# EAGLE design charging_block_v3 (EAGLE 8.2.1)
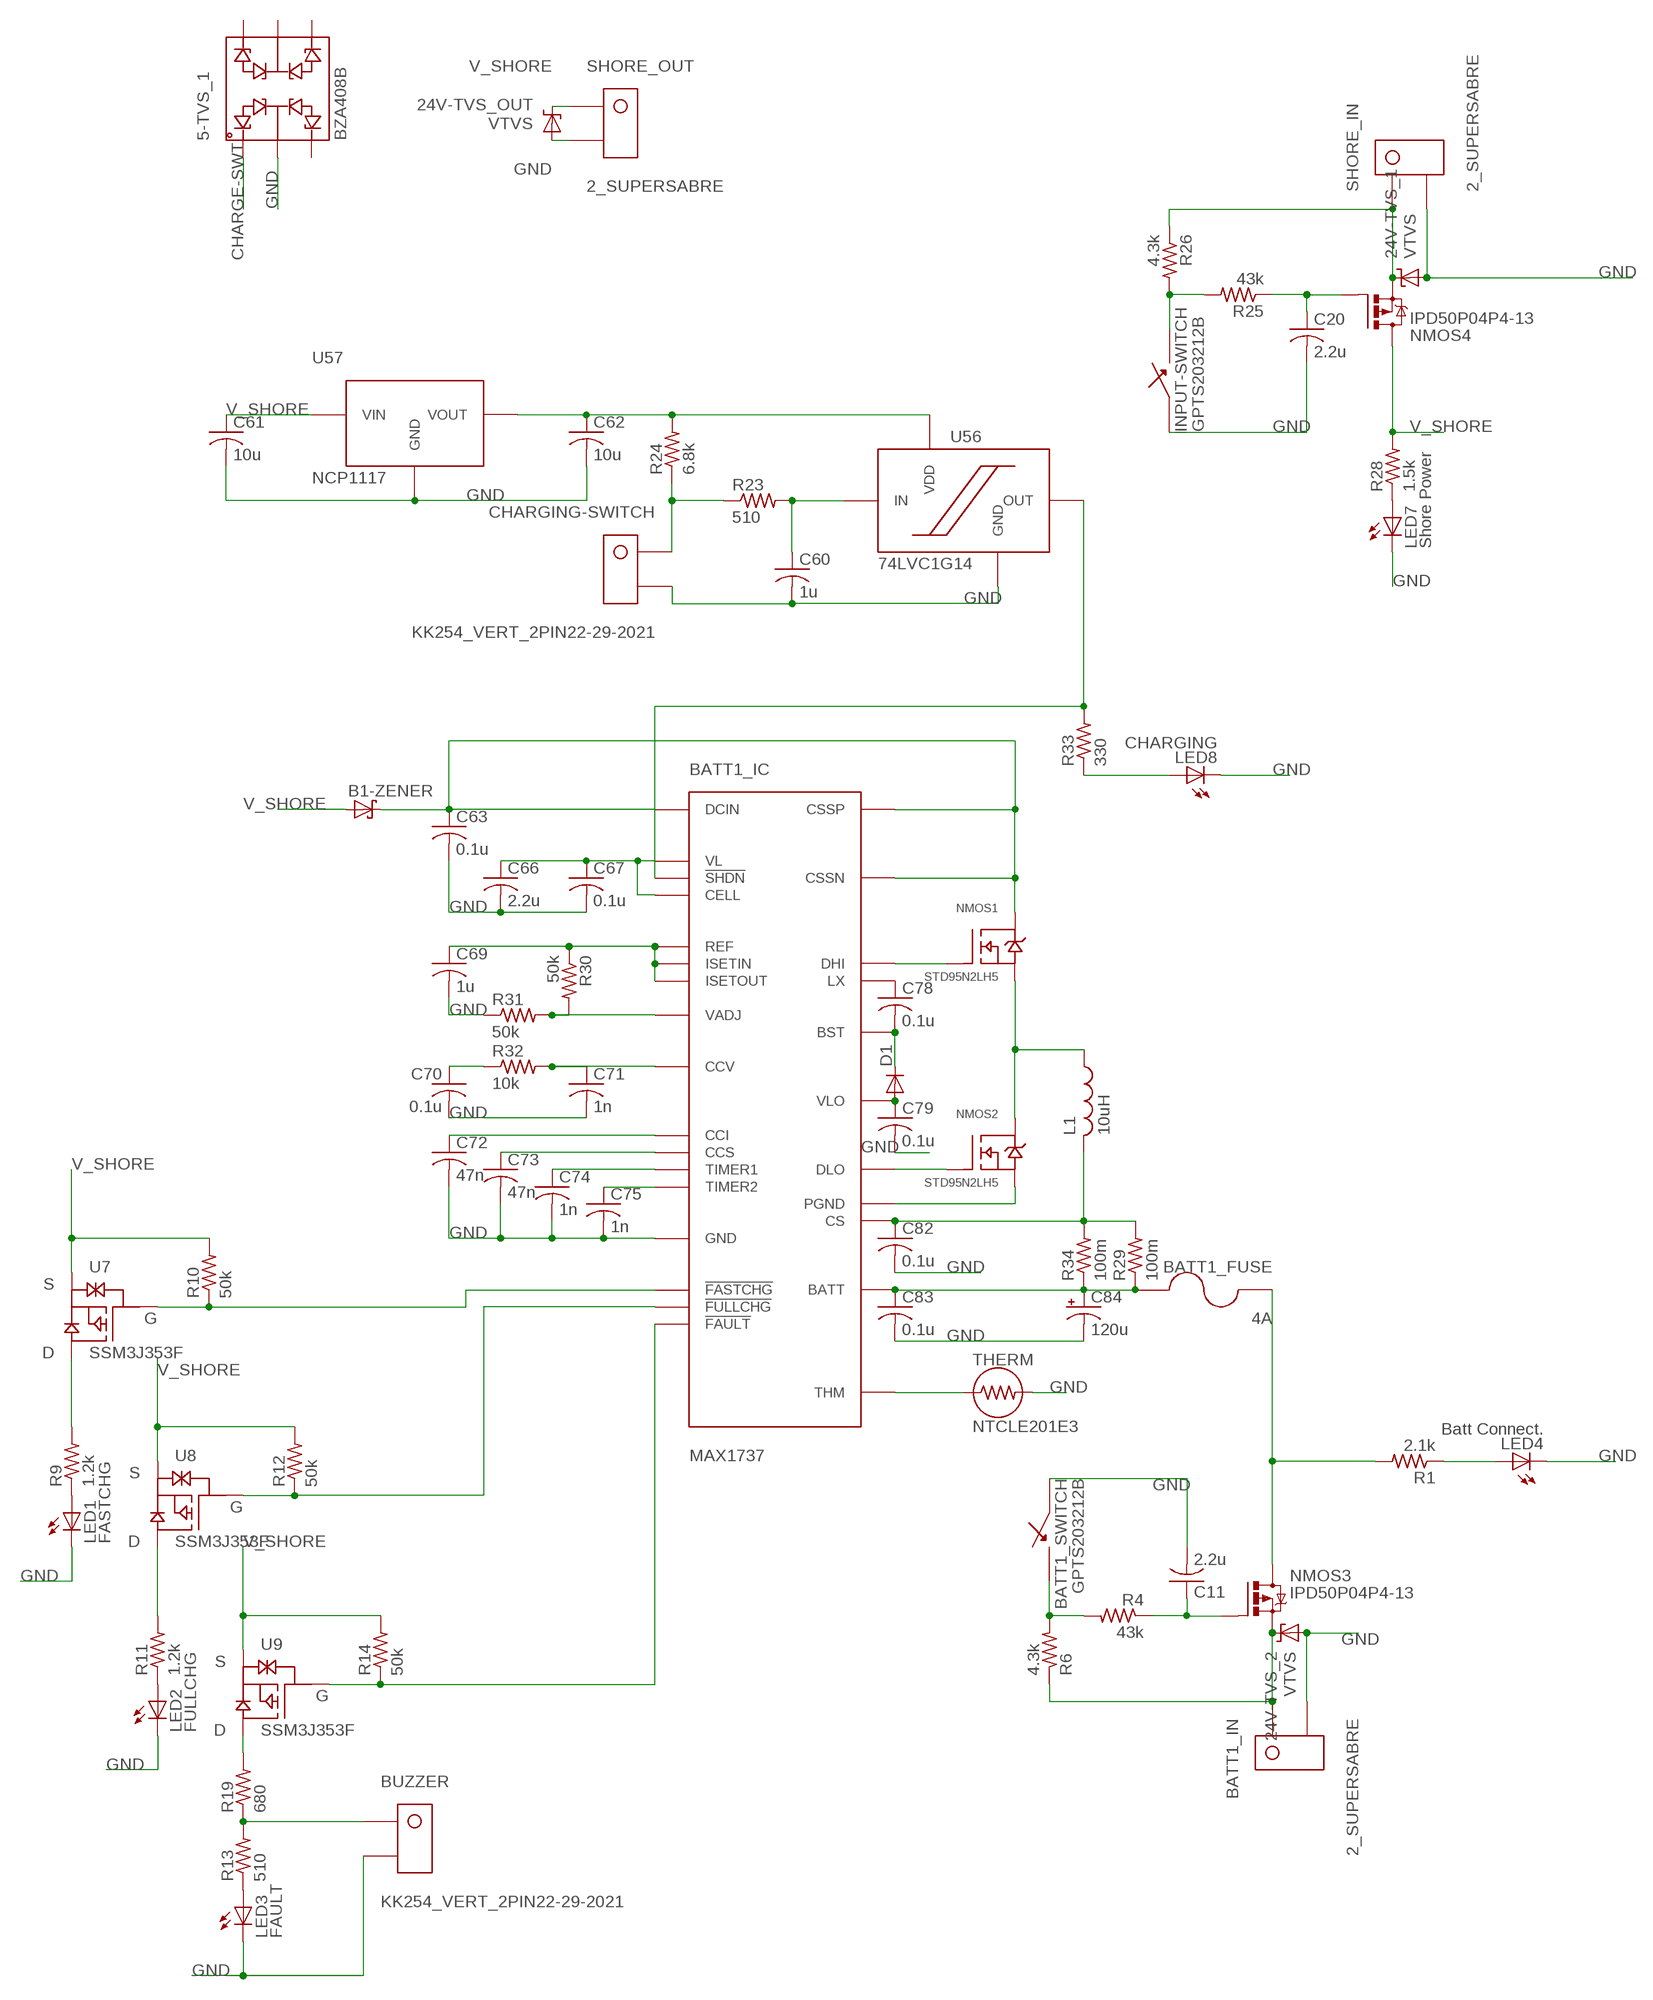
[diagram p0: schematic, sheet 1]

## Parts
5-TVS_1  BZA408B  [SOT457]
24V-TVS_1  VTVS  [DO-219AB]
24V-TVS_2  VTVS  [DO-219AB]
24V-TVS_OUT  VTVS  [DO-219AB]
B1-ZENER  SCHOTTKY-DIODESOD-106  [SOD106-R]
BATT1_FUSE  4A  154-OMNI_BLOK  [154-OMNI-BLOK]
BATT1_IC  MAX1737  [QSOP28]
BATT1_IN  2_SUPERSABRE  [SUPERSABRE_2CIRCUIT]
BATT1_SWITCH  GPTS203212B  [GPTS203211B]
BUZZER  KK254_VERT_2PIN22-29-2021  [KK254_VERT_2PIN]
C11  2.2u  C-USC0805  [C0805]
C20  2.2u  C-USC0805  [C0805]
C60  1u  C-USC0805  [C0805]
C61  10u  C-USC0805  [C0805]
C62  10u  C-USC0805  [C0805]
C63  0.1u  C-USC0805  [C0805]
C66  2.2u  C-USC0805  [C0805]
C67  0.1u  C-USC0805  [C0805]
C69  1u  C-USC0805  [C0805]
C70  0.1u  C-USC0805  [C0805]
C71  1n  C-USC0805  [C0805]
C72  47n  C-USC0805  [C0805]
C73  47n  C-USC0805  [C0805]
C74  1n  C-USC0805  [C0805]
C75  1n  C-USC0805  [C0805]
C78  0.1u  C-USC0805  [C0805]
C79  0.1u  C-USC0805  [C0805]
C82  0.1u  C-USC0805  [C0805]
C83  0.1u  C-USC0805  [C0805]
C84  120u  CPOL-USE3.5-8  [E3,5-8]
CHARGING-SWITCH  KK254_VERT_2PIN22-29-2021  [KK254_VERT_2PIN]
D1  DIODE-SOD123  [SOD123]
INPUT-SWITCH  GPTS203212B  [GPTS203211B]
L1  10uH  L-USL6100  [L6100]
LED1  FASTCHG  LEDCHIP-LED0805  [CHIP-LED0805]
LED2  FULLCHG  LEDCHIP-LED0805  [CHIP-LED0805]
LED3  FAULT  LEDCHIP-LED0805  [CHIP-LED0805]
LED4  Batt Connect.  LEDCHIP-LED0805  [CHIP-LED0805]
LED7  Shore Power  LEDCHIP-LED0805  [CHIP-LED0805]
LED8  CHARGING  LEDCHIP-LED0805  [CHIP-LED0805]
NMOS1  STD95N2LH5  [DPAK]
NMOS2  STD95N2LH5  [DPAK]
NMOS3  IPD50P04P4-13  [TO252-3]
NMOS4  IPD50P04P4-13  [TO252-3]
R1  2.1k  R-US_R0805  [R0805]
R4  43k  R-US_R0805  [R0805]
R6  4.3k  R-US_R0805  [R0805]
R9  1.2k  R-US_R0805  [R0805]
R10  50k  R-US_R0805  [R0805]
R11  1.2k  R-US_R0805  [R0805]
R12  50k  R-US_R0805  [R0805]
R13  510  R-US_R0805  [R0805]
R14  50k  R-US_R0805  [R0805]
R19  680  R-US_R0805  [R0805]
R23  510  R-US_R0805  [R0805]
R24  6.8k  R-US_R0805  [R0805]
R25  43k  R-US_R0805  [R0805]
R26  4.3k  R-US_R0805  [R0805]
R28  1.5k  R-US_R0805  [R0805]
R29  100m  R-US_R2512  [R2512]
R30  50k  R-US_R0805  [R0805]
R31  50k  R-US_R0805  [R0805]
R32  10k  R-US_R0805  [R0805]
R33  330  R-US_R0805  [R0805]
R34  100m  R-US_R2512  [R2512]
SHORE_IN  2_SUPERSABRE  [SUPERSABRE_2CIRCUIT]
SHORE_OUT  2_SUPERSABRE  [SUPERSABRE_2CIRCUIT]
THERM  NTCLE201E3  [2-0.3MM-LEADS]
U7  SSM3J353F  [SOT-346-3/S-MINI]
U8  SSM3J353F  [SOT-346-3/S-MINI]
U9  SSM3J353F  [SOT-346-3/S-MINI]
U56  74LVC1G14  [TSSOP5]
U57  NCP1117  [SOT-223]

## Nets
!FASTCHG!_1: BATT1_IC.16(!FASTCHG!) R10.1 U7.P$1(G)
!FAULT!_1: BATT1_IC.15(!FAULT!) R14.1 U9.P$1(G)
!FULLCHG!_1: BATT1_IC.17(!FULLCHG!) R12.1 U8.P$1(G)
!SHDN!_1: BATT1_IC.18(!SHDN!) R33.2 U56.P$4(OUT)
BATT1_P: 24V-TVS_2.P$2(C) BATT1_IN.P$1 NMOS3.TAB(D) R6.1
BATT_1: BATT1_FUSE.P$2 BATT1_IC.7(BATT) C83.1 C84.+ R29.1 R34.1
CCI_1: BATT1_IC.11(CCI) C72.1
CCS_1: BATT1_IC.10(CCS) C73.1
CCV_1: BATT1_IC.9(CCV) C71.1 R32.2
CHARGE-SWT: 5-TVS_1.P$1 CHARGING-SWITCH.P$1 R23.1 R24.1
CHG-OUT_1: BATT1_FUSE.P$1 NMOS3.3(S) R1.2
DCIN_1: B1-ZENER.C BATT1_IC.26(CSSN) BATT1_IC.27(CSSP) BATT1_IC.28(DCIN) C63.1 NMOS1.TAB(D)
DHI1: BATT1_IC.25(DHI) NMOS1.1(G)
DLO1: BATT1_IC.21(DLO) NMOS2.1(G)
FET-G_1: C11.1 NMOS3.1(G) R4.1
GND: 5-TVS_1.P$2 24V-TVS_1.P$1(A) 24V-TVS_2.P$1(A) 24V-TVS_OUT.P$1(A) BATT1_IC.6(GND) BATT1_IN.P$2 BATT1_SWITCH.P$1 BUZZER.P$2 C11.2 C20.2 C60.2 C61.2 C62.2 C63.2 C66.2 C67.2 C69.2 C70.2 C71.2 C72.2 C73.2 C74.2 C75.2 C79.2 C82.2 C83.2 C84.- CHARGING-SWITCH.P$2 INPUT-SWITCH.P$1 LED1.C LED2.C LED3.C LED4.C LED7.C LED8.C R31.1 SHORE_IN.P$2 SHORE_OUT.P$2 THERM.P$2 U56.P$3(GND) U57.P$1(GND)
LIN_1: L1.P$1 NMOS1.3(S) NMOS2.TAB(D)
LOUT_1: BATT1_IC.19(CS) C82.1 L1.P$2 R29.2 R34.2
N$1: LED4.A R1.1
N$2: LED1.A R9.1
N$3: BATT1_IC.20(PGND) NMOS2.3(S)
N$12: LED3.A R13.1
N$22: LED2.A R11.1
N$23: R9.2 U7.P$2(D)
N$26: R11.2 U8.P$2(D)
N$29: BUZZER.P$1 R13.2 R19.1
N$30: R19.2 U9.P$2(D)
N$35: LED7.A R28.1
N$47: C20.1 NMOS4.1(G) R25.1
N$49: C60.1 R23.2 U56.P$2(IN)
N$51: INPUT-SWITCH.P$2 R25.2 R26.2
N$52: BATT1_SWITCH.P$2 R4.2 R6.2
N$54: C62.1 R24.2 U56.P$5(VDD) U57.P$2(VOUT) U57.P$4(VOUT)
N$57: LED8.A R33.1
N$64: C70.1 R32.1
N$75: BATT1_IC.24(LX) C78.1
N$76: BATT1_IC.23(BST) C78.2 D1.C
N$83: BATT1_IC.22(VLO) C79.1 D1.A
REF_1: BATT1_IC.2(ISETIN) BATT1_IC.3(ISETOUT) BATT1_IC.5(REF) C69.1 R30.1
THM1: BATT1_IC.4(THM) THERM.P$1
TIMER1_1: BATT1_IC.13(TIMER1) C74.1
TIMER2_1: BATT1_IC.14(TIMER2) C75.1
V_SHORE: 24V-TVS_OUT.P$2(C) B1-ZENER.A C61.1 NMOS4.3(S) R10.2 R12.2 R14.2 R28.2 SHORE_OUT.P$1 U7.P$3(S) U8.P$3(S) U9.P$3(S) U57.P$3(VIN)
VADJ_1: BATT1_IC.8(VADJ) R30.2 R31.2
VIN: 24V-TVS_1.P$2(C) NMOS4.TAB(D) R26.1 SHORE_IN.P$1
VL_1: BATT1_IC.1(VL) BATT1_IC.12(CELL) C66.1 C67.1
Unconnected: 5-TVS_1.P$3 5-TVS_1.P$4 5-TVS_1.P$5 5-TVS_1.P$6

## Library data of the parts
5-TVS_1 = diodes:BZA408B: Nexperia BZA408B 5V TVS diode Datasheet <http://www.mouser.com/ds/2/302/BZA408B-841090.pdf>
24V-TVS_1 24V-TVS_2 24V-TVS_OUT = diode:VTVS: Vishay VTVS5V0ASMF to VTVS63GSMF 400W TVS diodes Datasheet <http://www.mouser.com/ds/2/427/vtvs5v0asmf-1078013.pdf>
B1-ZENER = diode:SCHOTTKY-DIODE: Schottky Diode
BATT1_FUSE = littelfuse:154-OMNI_BLOK: Littelfuse NANO2 Series 154 Omni-Blok fuseholder Datasheet <http://www.mouser.com/ds/2/240/Littelfuse_Fuse_154_154T_154L_154TL_Datasheet.pdf-309941.pdf>
BATT1_IC = maxim:MAX1737: Maxim MAX1737 Stand-Alone Switch-Mode Lithium-Ion Battery-Charger Controller 1-4 cell LiPo charge controller IC Datasheet <https://datasheets.maximintegrated.com/en/ds/MAX1737.pdf>
BATT1_IN SHORE_IN SHORE_OUT = molex:2_SUPERSABRE: Molex SuperSabre 2-pin vertical header
BATT1_SWITCH INPUT-SWITCH = switches:GPTS203212B: CW Industries Pushbutton SPST switch ON-OFF, 1A, 30VDC Datasheet <http://switches-connectors-custom.cwind.com/Asset/GPTS203211BR2.pdf>
BUZZER CHARGING-SWITCH = molex:KK254_VERT_2PIN: KK® 254 Wire-to-Board Header, Vertical, with Friction Lock, 2 Circuits, Gold (Au) Plating Part Number: 22-29-2021 http://www.molex.com/molex/products/datasheet.jsp?part=active/0022292021_PCB_HEADERS.xml
C11 C20 C60-C63 C66 C67 C69-C75 C78 C79 C82 C83 = resistor:C-US: CAPACITOR, American symbol
C84 = resistor:CPOL-US: POLARIZED CAPACITOR, American symbol
D1 = diode:DIODE-: DIODE
L1 = resistor:L-US: INDUCTOR, American symbol
LED1-LED4 LED7 LED8 = led:LED: LED OSRAM: - CHIPLED LG R971, LG N971, LY N971, LG Q971, LY Q971, LO R971, LY R971 LH N974, LH R974 LS Q976, LO Q976, LY Q976 LO Q996 - Hyper CHIPLED LW Q18S LB Q993, LB Q99A, LB R99A - SideLED LS A670, LO A670, LY A670, LG A670, LP A670 LB A673, LV A673, LT A673, LW A673 LH A674 LY A675 LS A676, LA A676, LO A676, LY A676, LW A676 LS A679, LY A679, LG A679 - Hyper Micro SIDELED® LS Y876, LA Y876, LO Y876, LY Y876 LT Y87S - SmartLED LW L88C, LW L88S LB L89C, LB L89S, LG L890 LS L89K, LO L89K, LY L89K LS L896, LA L896, LO L896, LY L896 - TOPLED LS T670, LO T670, LY T670, LG T670, LP T670 LSG T670, LSP T670, LSY T670, LOP T670, LYG T670 LG T671, LOG T671, LSG T671 LB T673, LV T673, LT T673, LW T673 LH T674 LS T676, LA T676, LO T676, LY T676, LB T676, LH T676, LSB T676, LW T676 LB T67C, LV T67C, LT T67C, LS T67K, LO T67K, LY T67K, LW E67C LS E67B, LA E67B, LO E67B, LY E67B, LB E67C, LV E67C, LT E67C LW T67C LS T679, LY T679, LG T679 LS T770, LO T770, LY T770, LG T770, LP T770 LB T773, LV T773, LT T773, LW T773 LH T774 LS E675, LA E675, LY E675, LS T675 LS T776, LA T776, LO T776, LY T776, LB T776 LHGB T686 LT T68C, LB T68C - Hyper Mini TOPLED® LB M676 - Mini TOPLED Santana® LG M470 LS M47K, LO M47K, LY M47K Source: http://www.osram.convergy.de LUXEON: - LUMILED® LXK2-PW12-R00, LXK2-PW12-S00, LXK2-PW14-U00, LXK2-PW14-V00 LXK2-PM12-R00, LXK2-PM12-S00, LXK2-PM14-U00 LXK2-PE12-Q00, LXK2-PE12-R00, LXK2-PE12-S00, LXK2-PE14-T00, LXK2-PE14-U00 LXK2-PB12-K00, LXK2-PB12-L00, LXK2-PB12-M00, LXK2-PB14-N00, LXK2-PB14-P00, LXK2-PB14-Q00 LXK2-PR12-L00, LXK2-PR12-M00, LXK2-PR14-Q00, LXK2-PR14-R00 LXK2-PD12-Q00, LXK2-PD12-R00, LXK2-PD12-S00 LXK2-PH12-R00, LXK2-PH12-S00 LXK2-PL12-P00, LXK2-PL12-Q00, LXK2-PL12-R00 Source: www.luxeon.com KINGBRIGHT: KA-3528ASYC Source: www.kingbright.com
NMOS1 NMOS2 = transistors:STD95N2LH5: ST STD95N2LH5 NMOS Power FET Datasheet <http://www.mouser.com/ds/2/389/std95n2lh5-955773.pdf>
NMOS3 NMOS4 = transistor-power:IPD50P04P4-13: Infineon IPD50P04P4-13 OptiMOS®-P2 Power-Transistor Datasheet <http://www.mouser.com/ds/2/196/Infineon-IPD50P04P4-13-DS-v01_02-EN-336147.pdf>
R1 R4 R6 R9-R14 R19 R23-R26 R28-R34 = resistor:R-US_: RESISTOR, American symbol
THERM = vishay:NTCLE201E3: Vishay NTC Thermistor Part No. NTCLE201E3 Datasheet <http://www.mouser.com/ds/2/427/ntclesb-278158.pdf>
U7-U9 = transistors:SSM3J353F: Toshiba SSM3J353F Small signal PMOS Datasheet <http://www.mouser.com/ds/2/408/SSM3J353F_datasheet_en_20161219-981025.pdf>
U56 = NXP:74LVC1G14: Nexperia 74LVC1G14 Single Schmitt trigger inverter Datasheet <http://www.mouser.com/ds/2/302/74LVC1G14_Q100-839654.pdf>
U57 = ONSemi:NCP1117: ON Semiconductor NCP1117 5V 1A Fixed LDO Datasheet <http://www.mouser.com/ds/2/308/NCP1117-D-81326.pdf>

## Board
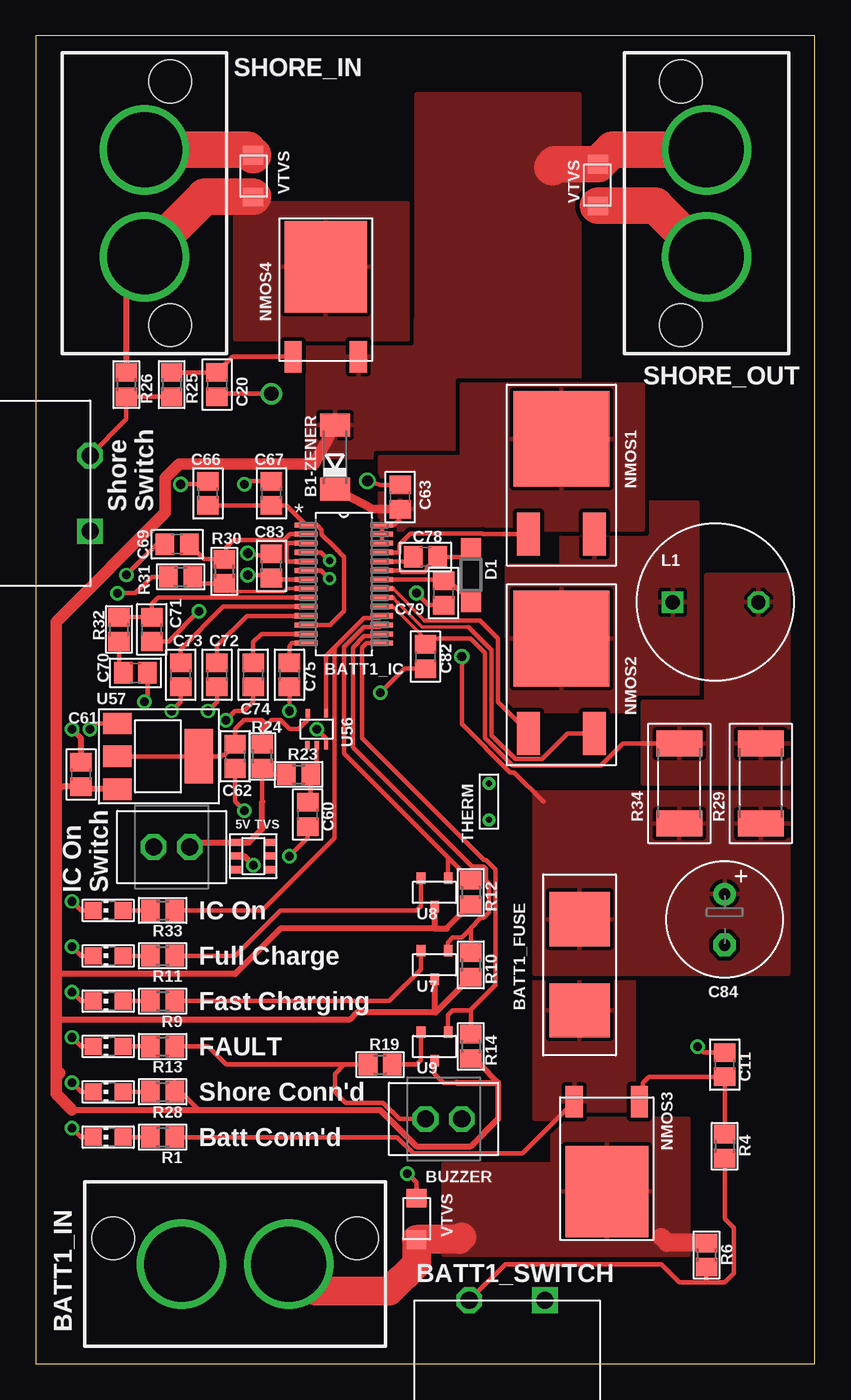
[diagram p1: board, top side]
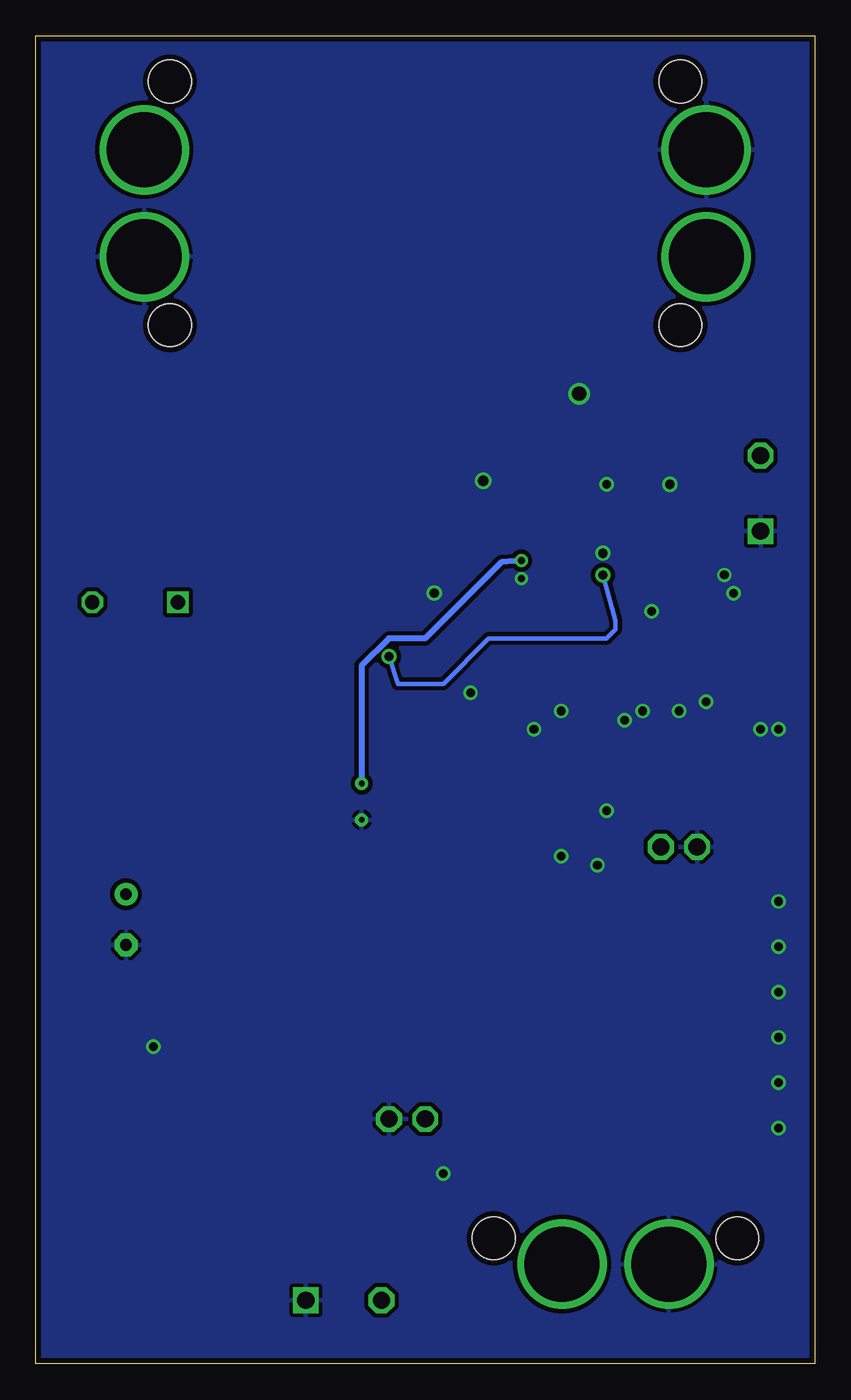
[diagram p2: board, bottom side, seen from below]

Size 54.59 x 93.02 mm. Coordinates in mm from the lower left corner, seen from the top.
Outline: 0,0 54.59,0 54.59,93.02 0,93.02 0,0
Copper layers (1*16): Top 0.035559375mm / dielectric 1.501140625mm / Bottom 0.035559375mm
Design rules "typical_4pcb": minimum track width 10mil, minimum drill 15mil, track to track 6mil, track to pad 6mil, pad to pad 6mil, via to via 6mil, smd to smd 6mil, copper to edge 15mil, drill to drill 8mil, minimum pad ring 10mil, minimum via ring 8mil, stop-mask expansion 4mil, vias tented up to drill 0mil, thermal gap 10mil

### Footprints (pad centres in the part's own frame; a part is rotated, then mirrored left to right if it is on the bottom)
SOT457 = smd 0.5 x 0.8: P$1 -0.95,-1.15; P$2 0,-1.15; P$3 0.95,-1.15; P$4 0.95,1.15; P$5 0,1.15; P$6 -0.95,1.15
DO-219AB = smd 1.3 x 1.4: P$1 -1.45,0; P$2 1.45,0
SOD106-R = smd 1.6 x 2.1: A 2.25,0; C -2.25,0
154-OMNI-BLOK = smd 3.81 x 4.242: P$1 -3.188,0; P$2 3.188,0
QSOP28 = smd 1.6 x 0.356: 1 -2.654,4.128; 2 -2.654,3.493; 3 -2.654,2.857; 4 -2.654,2.223; 5 -2.654,1.587; 6 -2.654,0.953; 7 -2.654,0.318; 8 -2.654,-0.318; 9 -2.654,-0.953; 10 -2.654,-1.587; 11 -2.654,-2.223; 12 -2.654,-2.857; 13 -2.654,-3.493; 14 -2.654,-4.128; 15 2.654,-4.128; 16 2.654,-3.493; 17 2.654,-2.857; 18 2.654,-2.223; 19 2.654,-1.587; 20 2.654,-0.953; 21 2.654,-0.318; 22 2.654,0.318; 23 2.654,0.953; 24 2.654,1.587; 25 2.654,2.223; 26 2.654,2.857; 27 2.654,3.493; 28 2.654,4.128
SUPERSABRE_2CIRCUIT = drill 5.25: P$1 -3.747,0; P$2 3.747,0 | hole 2.997: -8.534,-1.803; 8.534,-1.803
GPTS203211B = drill 1.2 square: P$1 0,-2.65 | drill 1.2 octagon: P$2 0,2.65
KK254_VERT_2PIN = drill 1.2 octagon: P$1 1.27,0; P$2 -1.27,0
C0805 = smd 1.3 x 1.5: 1 -0.85,0; 2 0.85,0
E3,5-8 = drill 0.813 pad 1.6: + -1.778,0 | drill 0.813 pad 1.6 octagon: - 1.778,0
SOD123 = smd 1.4 x 1.4: A 1.9,0; C -1.9,0
L6100 = drill 1 square: P$1 -3,0 | drill 1 octagon: P$2 3,0
CHIP-LED0805 = smd 1.2 x 1.2: A 0,-1.05; C 0,1.05
DPAK = smd 3 x 1.6: 1 1.57,-2.3; 3 1.57,2.3 | smd 6.7 x 6.7: TAB -5.08,0
TO252-3 = smd 1.2 x 2.2: 1 -2.28,-6.3; 3 2.28,-6.3 | smd 5.8 x 6.4: TAB 0,0
R0805 = smd 1.3 x 1.5: 1 -0.85,0; 2 0.85,0
R2512 = smd 1.8 x 3.2: 1 -2.8,0; 2 2.8,0
2-0.3MM-LEADS = drill 0.4: P$1 -1.27,0; P$2 1.27,0
SOT-346-3/S-MINI = smd 0.6 x 0.8: P$1 -0.95,-1; P$2 0.95,-1; P$3 0,1
TSSOP5 = smd 0.3 x 0.6: P$1 -0.65,-1.125; P$2 0,-1.125; P$3 0.65,-1.125; P$4 0.65,1.125; P$5 -0.62,1.125
SOT-223 = smd 1.5 x 2: P$1 -2.3,-3.15; P$2 0,-3.15; P$3 2.3,-3.15 | smd 3.8 x 2: P$4 0,2.54

### Placement (x,y rotation side)
5-TVS_1  15.24,35.56 270 top
24V-TVS_1  15.24,83.19 270 top
24V-TVS_2  26.67,10.16 270 top
24V-TVS_OUT  39.37,82.55 90 top
B1-ZENER  20.95,63.5 90 top
BATT1_FUSE  38.1,27.94 90 top
BATT1_IC  21.59,54.61 0 top
BATT1_IN  13.97,6.99 180 top
BATT1_SWITCH  33.02,4.45 90 top
BUZZER  28.57,17.14 180 top
C11  48.26,20.95 90 top
C20  12.7,68.58 270 top
C60  19.05,38.48 270 top
C61  3.17,41.27 90 top
C62  13.97,42.55 270 top
C63  25.53,60.71 90 top
C66  12.06,60.96 90 top
C67  16.51,60.96 90 top
C69  9.91,57.4 180 top
C70  6.99,48.39 0 top
C71  8.13,51.44 270 top
C72  12.7,48.26 270 top
C73  10.16,48.26 270 top
C74  15.24,48.26 270 top
C75  17.78,48.26 270 top
C78  27.3,56.52 0 top
C79  28.57,53.98 270 top
C82  27.3,49.53 270 top
C83  16.51,55.88 90 top
C84  48.26,31.11 270 top
CHARGING-SWITCH  9.53,36.2 0 top
D1  30.48,55.24 270 top
INPUT-SWITCH  3.81,60.96 0 top
L1  47.62,53.34 0 top
LED1  5.08,25.4 90 top
LED2  5.08,28.57 90 top
LED3  5.08,22.23 90 top
LED4  5.08,15.88 90 top
LED7  5.08,19.05 90 top
LED8  5.08,31.75 90 top
NMOS1  36.83,59.69 270 top
NMOS2  36.83,45.72 270 top
NMOS3  40.01,12.06 180 top
NMOS4  20.32,76.83 0 top
R1  8.89,15.88 0 top
R4  48.26,15.24 270 top
R6  46.99,7.62 270 top
R9  8.89,25.4 0 top
R10  30.48,27.94 270 top
R11  8.89,28.57 0 top
R12  30.48,33.02 270 top
R13  8.89,22.23 0 top
R14  30.48,22.23 270 top
R19  24.13,20.95 0 top
R23  18.41,41.27 0 top
R24  15.88,42.55 90 top
R25  9.53,68.58 270 top
R26  6.35,68.58 270 top
R28  8.89,19.05 0 top
R29  50.8,40.64 90 top
R30  13.21,55.5 270 top
R31  10.16,55.12 0 top
R32  5.84,51.44 90 top
R33  8.89,31.75 0 top
R34  45.09,40.64 90 top
SHORE_IN  7.62,81.28 90 top
SHORE_OUT  46.99,81.28 270 top
THERM  31.75,39.37 270 top
U7  27.94,27.94 180 top
U8  27.94,33.02 180 top
U9  27.94,22.23 180 top
U56  19.68,44.45 0 top
U57  8.89,42.55 270 top

### Tracks (layer width: path | path; a pad name or v marks a point on that pad's centre or on a via)
!FASTCHG!_1
  Top 0.305: BATT1_IC.16 24.09,50.97 23.01,50.97 22.23,50.18 22.23,43.17 30.57,34.83 31.36,34.83 31.54,34.65 31.54,33.87 31.75,33.66 31.75,31.61 31.36,31.21 31.16,31.21 30.45,30.5 30.48,30.48 | 30.48,30.48 R10.1 | U7.P$1 28.89,29.52 29.21,29.84 29.84,29.84 30.48,30.48
!FAULT!_1
  Top 0.305: BATT1_IC.15 23.18,50.48 22.86,50.16 22.86,43.81 31.39,35.28 31.55,35.28 32.21,34.62 32.21,26.54 30.45,24.79 30.48,24.77 | 30.48,24.77 R14.1 | U9.P$1 28.89,24.45 29.21,24.77 30.48,24.77
!FULLCHG!_1
  Top 0.305: BATT1_IC.17 24.09,51.6 23,51.6 21.59,50.19 21.59,42.76 28.89,35.46 | 28.89,35.46 R12.1 | U8.P$1 28.89,35.46
!SHDN!_1
  Top 0.305: BATT1_IC.18 24.09,52.23 22.99,52.23 20.94,50.18 | U56.P$4 20.34,49.58 20.94,50.18 | 20.94,50.18 20.94,36.81 15.88,31.75 R33.2
BATT1_P
  Top 1.27: R6.1 44.23,8.47 43.81,8.89
  Top 2.032: 29.84,8.89 29.66,8.71 24V-TVS_2.P$2 26.67,6.99 24.77,5.08 19.62,5.08 BATT1_IN.P$1
  pour Top (isolate 0.305, rank 2): 36.2,17.14 45.72,17.14 45.72,7.62 28.57,7.62 28.57,13.97 36.2,13.97
BATT_1  (via drill 0.65)
  Top 0.305: BATT1_IC.7 16.61,54.93 C83.1 16.3,55.24 v14.86,55.24 | 35.56,39.37 33.5,41.43 33.23,41.43 29.84,44.81 v29.84,49.53
  Bottom 0.305: v14.86,55.24 13.97,52.07 13.97,51.44 14.61,50.8 22.86,50.8 26.04,47.62 29.21,47.62 v29.84,49.53
  pour Top (isolate 0.305): 52.7,40.01 34.92,40.01 34.92,27.3 52.7,27.3
CCI_1
  Top 0.305: C72.1 12.7,50.29 14.8,52.39 BATT1_IC.11
CCS_1
  Top 0.305: C73.1 10.16,50.04 13.14,53.02 BATT1_IC.10
CCV_1
  Top 0.305: BATT1_IC.9 8.57,53.66 8.13,53.21 C71.1 R32.2
CHARGE-SWT
  Top 0.305: 15.88,39.37 15.88,41.27 | 15.88,41.27 R24.1 | R23.1 15.88,41.27
  Top 0.406: CHARGING-SWITCH.P$1 11.11,36.51 5-TVS_1.P$1 14.92,36.51 15.88,37.47 15.88,39.37
CHG-OUT_1
  Top 0.305: R1.2 25.32,15.88 26.46,14.73 34.09,14.73 NMOS3.3
  pour Top (isolate 0.305, rank 3): 34.92,17.14 41.91,17.14 41.91,27.3 34.92,27.3
DCIN_1
  Top 0.305: BATT1_IC.26 BATT1_IC.27 BATT1_IC.28 25.08,58.74 25.4,59.05 25.4,59.73 C63.1
  Top 0.61: C63.1 23.62,59.86 B1-ZENER.C
  pour Top (isolate 0.305): 24.13,63.5 24.13,58.42 42.55,58.42 42.55,68.58 29.84,68.58 29.84,63.5
DHI1
  Top 0.305: BATT1_IC.25 25.5,56.83 25.5,57.39 26.26,58.15 31.31,58.15 31.34,58.12 NMOS1.1
DLO1
  Top 0.254: 25.02,54.29 27.24,52.07
  Top 0.305: 27.24,52.07 31.11,52.07 32.38,50.8 32.38,46.35 34.53,44.21 NMOS2.1 | BATT1_IC.21 25.02,54.29
FET-G_1
  Top 0.305: R4.1 C11.1 42.97,20.11 42.55,19.68 42.55,18.62 NMOS3.1
GND  (via drill 0.5, 0.6, 0.65, 0.75, 1)
  Top 0.305: BATT1_IC.6 20,55.56 v20.57,54.99 | C79.2 27.52,53.12 v26.67,53.98 | C63.2 24.17,61.56 v23.24,61.85 | C83.2 16.3,56.52 v14.86,56.77 | C66.2 11.85,61.59 v10.16,61.59 | C20.2 12.91,67.94 v16.51,67.94 | LED4.C 3.17,15.88 v2.54,16.51 | LED7.C 3.17,19.05 v2.54,19.68 | LED3.C 3.17,22.23 v2.54,22.86 | LED1.C 3.17,25.4 v2.54,26.04 | LED2.C 3.17,28.57 v2.54,29.21 | LED8.C 3.17,31.75 v2.54,32.38 | C11.2 46.77,21.8 v46.35,22.23 | 24V-TVS_2.P$1 26.67,12.7 v26.04,13.34 | U56.P$3 20.34,43.8 v19.68,44.45 | U57.P$1 4.21,44.84 v3.81,44.45 | C70.2 7.83,46.57 v7.62,46.35 | C73.2 10.16,46.35 v9.53,45.72 | C75.2 v17.78,45.72 | C82.2 25.82,48.68 v24.13,46.99 | C62.2 13.97,39.37 v14.61,38.73 | C60.2 19.05,36.83 v17.78,35.56 | C71.2 9.31,50.59 v11.43,52.7 | C74.2 15.24,46.35 14.61,45.72 13.97,45.72 v13.34,45.09 | C72.2 12.7,46.35 v12.06,45.72 | R31.1 8.13,55.12 6.99,53.98 v5.71,53.98 | C69.2 8.51,57.4 v6.35,55.24 | C67.2 14.82,61.81 v14.61,61.59
  Top 0.406: C61.2 3.17,43.81 v2.54,44.45 | 5-TVS_1.P$2 14.61,35.56 v15.24,34.92
  Top 2.54: 24V-TVS_1.P$1 14.85,85.03 SHORE_IN.P$2 | 24V-TVS_OUT.P$1 43.42,81.1 SHORE_OUT.P$2
  pour Bottom (isolate 0.305): -1.91,92.71 56.52,92.71 56.52,-1.91 -1.91,-1.91
LIN_1
  pour Top (isolate 0.305, rank 2): 33.02,45.72 33.02,55.88 36.83,55.88 36.83,60.33 46.35,60.33 46.35,45.72
LOUT_1
  Top 0.254: BATT1_IC.19 25.03,53.02 27.3,50.75 C82.1
  Top 0.305: C82.1 27.73,50.8 30.47,50.8 31.47,49.8 31.47,43.83 33.41,41.89 39.6,41.89 41.15,43.44 R34.2
  pour Top (isolate 0.305): 46.99,55.24 52.7,55.24 52.7,40.64 42.55,40.64 42.55,46.35 46.99,46.35
N$1
  Top 0.305: R1.1 LED4.A
N$2
  Top 0.305: R9.1 LED1.A
N$3
  Top 0.254: 30.3,51.61 27.05,51.61 25.35,53.31 | 25.35,53.33 25.02,53.66
  Top 0.305: NMOS2.3 37.26,44.15 35.46,42.34 33.6,42.34 31.93,44.02 31.93,49.99 30.3,51.61 | 25.35,53.31 25.35,53.33 | 25.02,53.66 BATT1_IC.20
N$12
  Top 0.305: R13.1 LED3.A
N$22
  Top 0.305: R11.1 LED2.A
N$23
  Top 0.305: U7.P$2 26.99,27.62 24.77,25.4 R9.2
N$26
  Top 0.305: U8.P$2 26.99,32.07 26.67,31.75 17.14,31.75 13.97,28.57 R11.2
N$29
  Top 0.305: 21.59,20.95 R19.1 | 21.59,20.95 13.34,20.95 12.06,22.23 R13.2 | BUZZER.P$1 25.48,17.14 24.34,18.29 21.72,18.29 20.95,19.05 20.95,20.32 21.59,20.95
N$30
  Top 0.305: U9.P$2 26.99,21.27 26.67,20.95 R19.2
N$35
  Top 0.305: R28.1 LED7.A
N$47
  Top 0.305: R25.1 C20.1 13.8,70.53 NMOS4.1
N$49
  Top 0.305: U56.P$2 19.68,41.7 R23.2 19.27,39.55 C60.1
N$51
  Top 0.305: INPUT-SWITCH.P$2 6.35,66.15 R26.2 R25.2
N$52
  Top 0.305: 46.99,5.71 45.09,5.71 43.81,6.99 32.91,6.99 BATT1_SWITCH.P$2 | 46.99,5.71 48.26,5.71 48.9,6.35 48.9,9.53 48.26,10.16 R4.2 | R6.2 46.99,5.71
N$54
  Top 0.305: R24.2 15.88,44.45 16.19,44.77 | 16.19,44.77 16.51,45.09 17.14,45.09 17.78,44.45 18.41,44.45 19.05,45.09 19.05,45.56 U56.P$5 | 16.19,44.77 15.88,45.09 14.61,45.09 13.97,44.45 C62.1 13.22,42.65 13.09,42.65 12.99,42.55 U57.P$4 U57.P$2
N$57
  Top 0.305: R33.1 LED8.A
N$64
  Top 0.305: R32.1 5.84,48.68 C70.1
N$75
  Top 0.305: BATT1_IC.24 26.14,56.2 C78.1
N$76
  Top 0.305: BATT1_IC.23 25.58,55.56 25.68,55.46 27.23,55.46 27.41,55.64 27.41,55.77 C78.2 29.85,56.52 D1.C
N$83
  Top 0.305: BATT1_IC.22 28.47,54.93 C79.1 29,54.83 D1.A
REF_1
  Top 0.305: C69.1 11.81,56.35 R30.1 13.34,56.48 13.34,57.15 13.87,57.69 17.39,57.69 | BATT1_IC.5 17.57,56.2 17.57,57.51 | 17.57,57.51 17.39,57.69 | BATT1_IC.3 17.6,57.47 17.57,57.51 | BATT1_IC.2 17.8,58.1 17.39,57.69
THM1  (via drill 0.5)
  Top 0.305: BATT1_IC.4 20,56.83 v20.57,56.26
  Bottom 0.406: 20.57,56.13 v20.57,56.26 21.97,56.13 27.3,50.8 29.84,50.8 31.75,48.9 THERM.P$1
TIMER1_1
  Top 0.305: C74.1 15.24,50.55 15.81,51.12 BATT1_IC.13
TIMER2_1
  Top 0.305: C75.1 17.78,50.27 17.98,50.47 18.92,50.47 BATT1_IC.14
V_SHORE
  Top 0.305: 11.43,17.78 10.16,19.05 | U9.P$3 27.94,20.32 28.57,19.68 29.48,19.68 | 5.5,40.01 U57.P$3 | 1.64,37.68 1.42,37.47
  Top 0.406: 30.48,20.95 R14.2 30.9,20.95 31.11,20.95 32.38,19.68 | 10.16,19.05 R28.2 | 1.42,24.13 22.01,24.13 22.48,24.6 27.99,24.6 | 27.99,24.6 R10.2 | 1.42,27.3 13.97,27.3 17.14,30.48 27.94,30.48 | 27.94,30.48 28.79,30.48 R12.2 | 2.54,17.78 11.43,17.78 24.13,17.78 26.67,15.24 30.48,15.24 32.38,17.14 32.38,19.68 | 29.48,19.68 32.38,19.68 | U7.P$3 27.94,24.65 27.99,24.6 | U8.P$3 27.94,30.48 | U57.P$3 3.35,40.24 C61.1 1.84,40.42 1.42,40.01
  Top 0.813: 1.42,20.32 1.42,24.13 1.42,27.3 1.42,37.47 1.42,40.01 1.42,51.96 9.07,59.61 9.07,62.05 10.05,63.02 19.49,63.02 B1-ZENER.A | 1.42,20.32 1.65,20.32 1.68,20.36 | R28.2 9.74,19.47 | 1.42,20.32 1.42,18.9 2.54,17.78
  Top 2.54: SHORE_OUT.P$1 40.4,85.03 24V-TVS_OUT.P$2 36.38,84 36.2,83.82
  pour Top (isolate 0.305, rank 2): 19.05,73.03 19.05,63.5 38.1,63.5 38.1,88.9 26.67,88.9 26.67,73.03
VADJ_1
  Top 0.254: BATT1_IC.8 17.57,54.29 17.38,54.1 13.76,54.1 R30.2
  Top 0.305: R30.2 11.48,54.65 R31.2
VIN
  Top 0.406: SHORE_IN.P$1 6.35,76.26 R26.1
  Top 2.54: SHORE_IN.P$1 11.82,81.73 24V-TVS_1.P$2
  pour Top (isolate 0.305): 13.97,71.75 26.04,71.75 26.04,81.28 13.97,81.28
VL_1
  Top 0.305: 21.15,56.95 20.95,57.15 | 20.95,57.15 20.04,58.06 20.04,58.41 19.71,58.74 BATT1_IC.1 17.56,60.11 C67.1 C66.1 | 20.95,57.15 21.59,56.52 21.59,52.7 20.64,51.75 BATT1_IC.12

### Text on the board
tPlace: VTVS | VTVS | Shore / Switch | 5V TVS | IC On / Switch | IC On | Full Charge | Fast Charging | FAULT | Shore Conn'd | Batt Conn'd | VTVS